# Altium project toasterBigBoard.PrjPcb
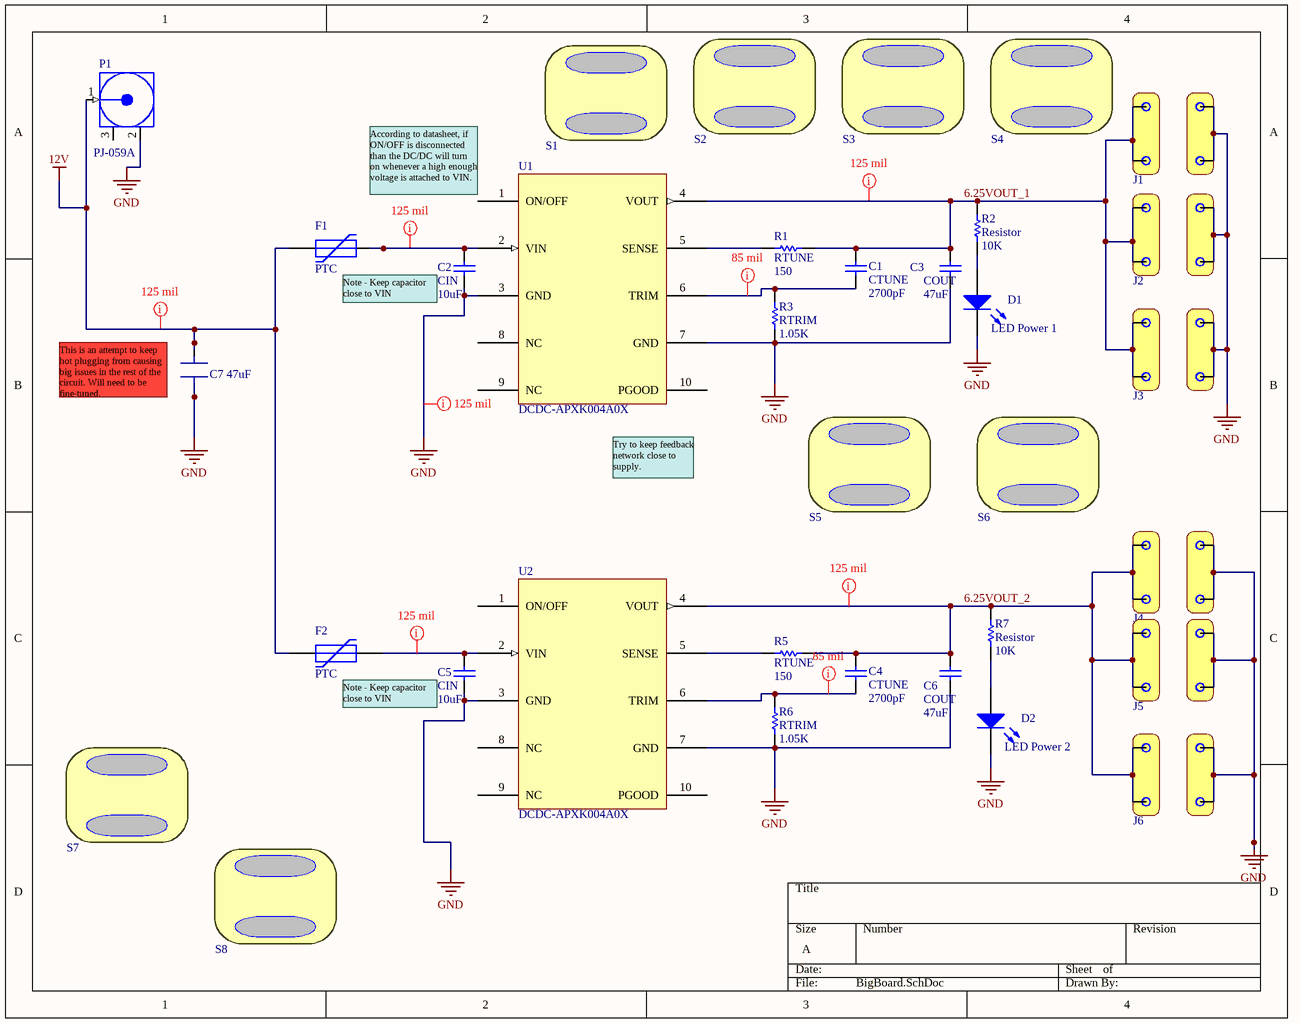
[diagram p0: BigBoard.SchDoc]
1 sheet, 34 parts. Net scope: global (net labels, ports and power ports of the same name join across sheets).
Board file: toasterBigBoard.PcbDoc

## Sheet BigBoard.SchDoc
size A

### Parts
C1  CTUNE  value 2700pF  [CAPC1608L]
C2  CIN  value 10uF  [CAPC2012L]
C3  COUT  value 47uF  [CAPC3216L]
C4  CTUNE  value 2700pF  [CAPC1608L]
C5  CIN  value 10uF  [CAPC2012L]
C6  COUT  value 47uF  [CAPC3216L]
C7_47uF  CapTant6032-28  [CapTant6032-28]  (value not drawn)
D1  LED Power 1  [SurfaceMount(603)]
D2  LED Power 2  [SurfaceMount(603)]
F1  PTC  [J1-1812]
F2  PTC  [J1-1812]
J1  ToasterChargerProng  [ToasterChargerProng]  (value not drawn)
J2  ToasterChargerProng  [ToasterChargerProng]  (value not drawn)
J3  ToasterChargerProng  [ToasterChargerProng]  (value not drawn)
J4  ToasterChargerProng  [ToasterChargerProng]  (value not drawn)
J5  ToasterChargerProng  [ToasterChargerProng]  (value not drawn)
J6  ToasterChargerProng  [ToasterChargerProng]  (value not drawn)
P1  PJ-059A  [PJ-059A]
R1  RTUNE  value 150  [J1-0603]
R2  Resistor  value 10K  [J1-0603]
R3  RTRIM  value 1.05K  [J1-0603]
R5  RTUNE  value 150  [J1-0603]
R6  RTRIM  value 1.05K  [J1-0603]
R7  Resistor  value 10K  [J1-0603]
S1  ToasterChargerZiptie  [TOASTERCHARGERZIPTIEREVISED2]  (value not drawn)
S2  ToasterChargerZiptie  [TOASTERCHARGERZIPTIEREVISED2]  (value not drawn)
S3  ToasterChargerZiptie  [TOASTERCHARGERZIPTIEREVISED2]  (value not drawn)
S4  ToasterChargerZiptie  [TOASTERCHARGERZIPTIEREVISED2]  (value not drawn)
S5  ToasterChargerZiptie  [TOASTERCHARGERZIPTIEREVISED2]  (value not drawn)
S6  ToasterChargerZiptie  [TOASTERCHARGERZIPTIEREVISED2]  (value not drawn)
S7  ToasterChargerZiptie  [TOASTERCHARGERZIPTIEREVISED2]  (value not drawn)
S8  ToasterChargerZiptie  [TOASTERCHARGERZIPTIEREVISED2]  (value not drawn)
U1  DCDC-APXK004A0X  [DCDC-APXK004A0X]
U2  DCDC-APXK004A0X  [DCDC-APXK004A0X]

### Nets
12V: C7_47uF.1 F1.1 F2.1 P1.1(VCC)
GND: C2.1 C3.1 C5.1 C6.1 C7_47uF.2 D1.2(K) D2.2(K) J1.3 J1.4 J2.3 J2.4 J3.3 J3.4 J4.3 J4.4 J5.3 J5.4 J6.3 J6.4 P1.2(GND) R3.1 R6.1 U1.3(GND) U1.7(GND) U2.3(GND) U2.7(GND)
6.25VOUT_1: C1.1 C3.2 J1.1 J1.2 J2.1 J2.2 J3.1 J3.2 R1.1 R2.1 U1.4(VOUT)
6.25VOUT_2: C4.1 C6.2 J4.1 J4.2 J5.1 J5.2 J6.1 J6.2 R5.1 R7.1 U2.4(VOUT)
NetC1_2: C1.2 R3.2 U1.6(TRIM)
NetC2_2: C2.2 F1.2 U1.2(VIN)
NetC4_2: C4.2 R6.2 U2.6(TRIM)
NetC5_2: C5.2 F2.2 U2.2(VIN)
NetD1_1: D1.1(A) R2.2
NetD2_1: D2.1(A) R7.2
NetR1_2: R1.2 U1.5(SENSE)
NetR5_2: R5.2 U2.5(SENSE)

Not connected (* = marked no-connect by the designer): P1 3; U1 1(ON/OFF) 8(NC) 9(NC) 10(PGOOD); U2 1(ON/OFF) 8(NC) 9(NC) 10(PGOOD)

### Layout directives
rule Width Constraint [Pref Width = 125mil    Min Width = 8mil    Max Width = 250mil]: 6.25VOUT_1, 6.25VOUT_2, GND
rule Width Constraint [Pref Width = 85mil    Min Width = 20mil    Max Width = 120mil]: NetC1_2, NetC4_2
rule Width Constraint [Pref Width = 125mil    Min Width = 20mil    Max Width = 250mil]: 12V, NetC2_2, NetC5_2

### Notes on the sheet
- According to datasheet, if ON/OFF is disconnected than the DC/DC will turn on whenever a high enough voltage is attached to VIN.
- Note - Keep capacitor close to VIN
- (near C7_47uF) This is an attempt to keep hot plugging from causing big issues in the rest of the circuit. Will need to be fine-tuned.
- (near U1) Try to keep feedback network close to supply.

### Library data of the parts
C1-C6 = Cap: Capacitor; Published: 8-Jun-2000; LatestRevisionDate: 17-Jul-2002; LatestRevisionNote: Re-released for DXP Platform.; PackageReference: RAD-0.3; Publisher: Altium Limited
C7_47uF = CapTant6032-28: Polarized Tantalum Capacitor for use in Toaster Charger
D1 D2 = LED
F1 F2 = PTC_FUSE: Fuse; Published: 8-Jun-2000; LatestRevisionDate: 17-Jul-2002; LatestRevisionNote: Re-released for DXP Platform.; PackageReference: PIN-W2/E2.8; Publisher: Altium Limited
J1-J6 = ToasterChargerProng: Charger Prong Footprint for Toaster Charger; Published: 24-Mar-1999; LatestRevisionDate: 17-Jul-2002; LatestRevisionNote: Re-released for DXP Platform.; PackageReference: RAD-0.2; Publisher: Altium Limited
R1 R3 R5 R6 = Resistor: Published: 8-Jun-2000; LatestRevisionDate: 17-Jul-2002; LatestRevisionNote: Re-released for DXP Platform.; PackageReference: AXIAL-0.3; Publisher: Altium Limited; PackageDescription: Axial Device, Thru-Hole; 2 Leads; 0.3 in Pin Spacing
S1-S8 = ToasterChargerZiptie: Slot for Ziptie connection between PCB and Toaster Charger
U1 U2 = DCDC-APXK004A0X: DC/DC converter for the rone charger
R2 R7 = Resistor: Published: 8-Jun-2000; LatestRevisionDate: 17-Jul-2002; LatestRevisionNote: Re-released for DXP Platform.; PackageReference: AXIAL-0.3; Publisher: Altium Limited; PackageDescription: Axial Device, Thru-Hole; 2 Leads; 0.3 in Pin Spacing